# Altium project PROJECT_W-F-FC-HX2X.PrjPcb
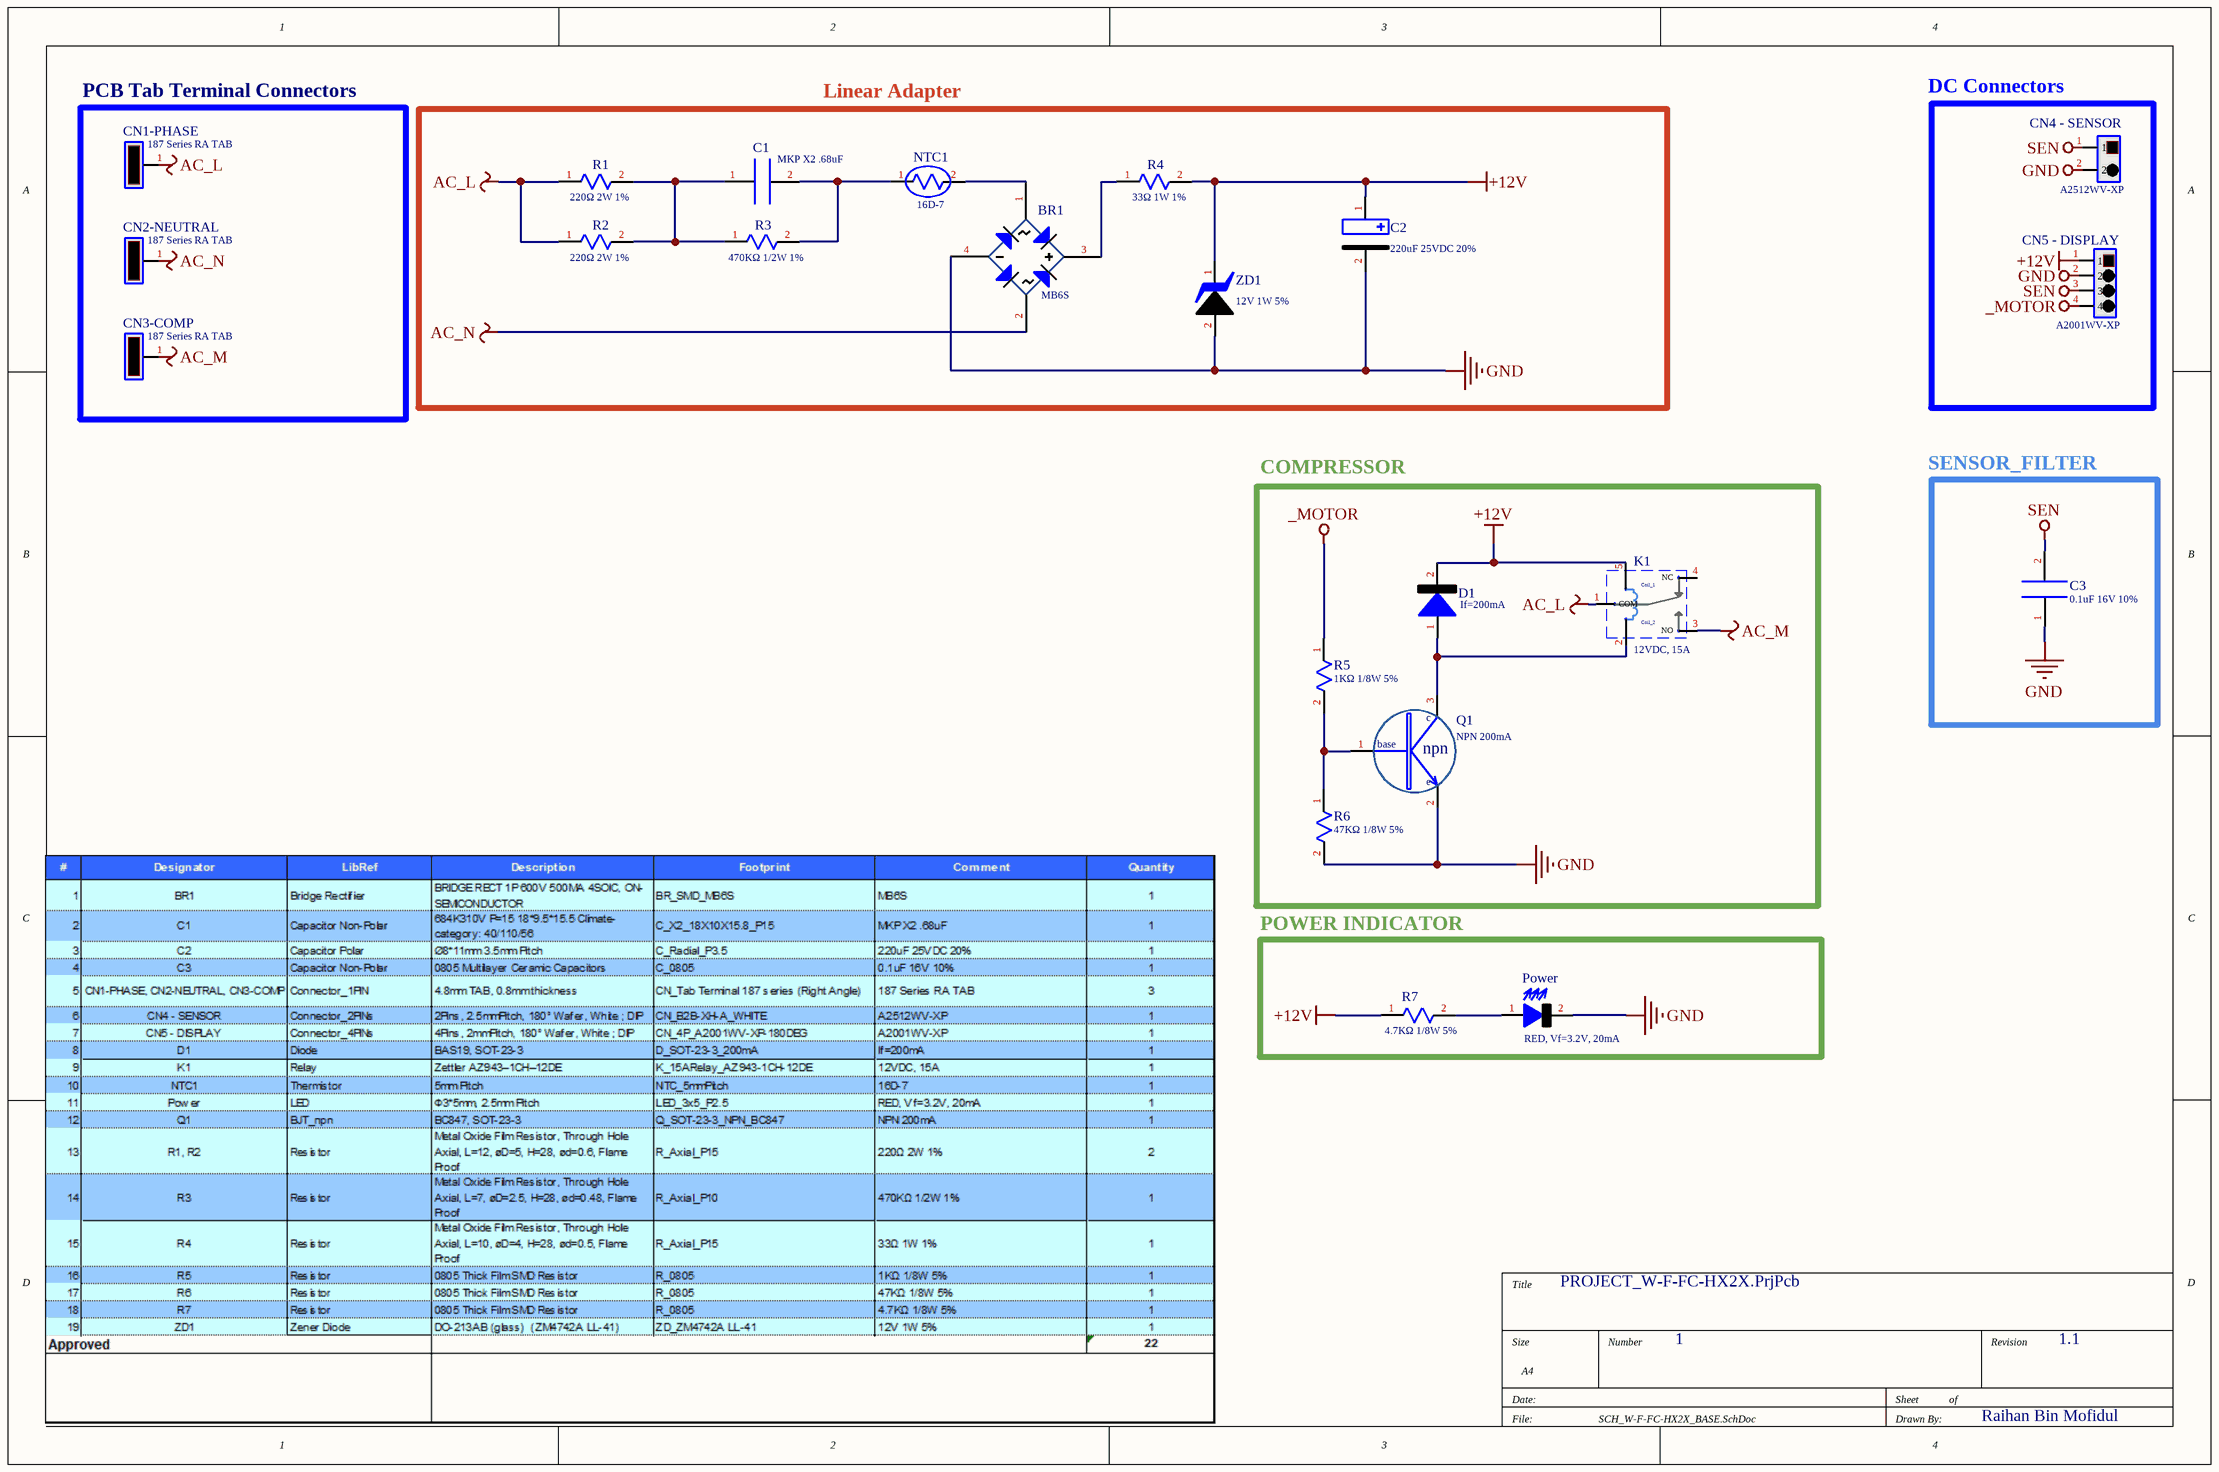
[diagram p0: SCH_W-F-FC-HX2X_BASE.SchDoc]
1 sheet, 22 parts. Net scope: global (net labels, ports and power ports of the same name join across sheets).
Board file: PCB_W-F-FC-HX2X_BASE.PcbDoc

## Sheet SCH_W-F-FC-HX2X_BASE.SchDoc
size A4

### Parts
BR1  MB6S  [BR_SMD_MB6S]
C1  MKP X2 .68uF  [C_X2_18X10X15.8_P15]
C2  220uF 25VDC 20%  [C_Radial_P3.5]
C3  0.1uF 16V 10%  [C_0805]
CN1-PHASE  187 Series RA TAB  [CN_Tab Terminal 187 series (Right Angle)]
CN2-NEUTRAL  187 Series RA TAB  [CN_Tab Terminal 187 series (Right Angle)]
CN3-COMP  187 Series RA TAB  [CN_Tab Terminal 187 series (Right Angle)]
CN4_-_SENSOR  A2512WV-XP  [CN_B2B-XH-A_WHITE]
CN5_-_DISPLAY  A2001WV-XP  [CN_4P_A2001WV-XP-180DEG]
D1  If=200mA  [D_SOT-23-3_200mA]
K1  12VDC, 15A  [K_15ARelay_AZ943-1CH-12DE]
NTC1  16D-7  [NTC_5mmPitch]
Power  RED, Vf=3.2V, 20mA  [LED_3x5_P2.5]
Q1  NPN 200mA  [Q_SOT-23-3_NPN_BC847]
R1  220Ω 2W 1%  [R_Axial_P15]
R2  220Ω 2W 1%  [R_Axial_P15]
R3  470KΩ 1/2W 1%  [R_Axial_P10]
R4  33Ω 1W 1%  [R_Axial_P15]
R5  1KΩ 1/8W 5%  [R_0805]
R6  47KΩ 1/8W 5%  [R_0805]
R7  4.7KΩ 1/8W 5%  [R_0805]
ZD1  12V 1W 5%  [ZD_ZM4742A LL-41]

### Blocks framed on the sheet
PCB Tab Terminal Connectors: CN1-PHASE CN2-NEUTRAL CN3-COMP
Linear Adapter: BR1 C1 C2 NTC1 R1-R4 ZD1
DC Connectors: CN4_-_SENSOR CN5_-_DISPLAY
COMPRESSOR: D1 K1 Q1 R5 R6
SENSOR_FILTER: C3
POWER INDICATOR: Power R7

### Nets
+12V: C2.1(vdd) CN5_-_DISPLAY.1 D1.2(vss) K1.5(COIL1) R4.2 R7.1 ZD1.1(VCC)
_MOTOR: CN5_-_DISPLAY.4 R5.1
AC_L: CN1-PHASE.1 K1.1(COM) R1.1 R2.1
AC_M: CN3-COMP.1 K1.3(NO)
AC_N: BR1.2(AC) CN2-NEUTRAL.1
GND: BR1.4(vss) C2.2(vss) C3.1 CN4_-_SENSOR.2 CN5_-_DISPLAY.2 Power.2(vss) Q1.2(Emitter) R6.2 ZD1.2(GND)
SEN: C3.2 CN4_-_SENSOR.1 CN5_-_DISPLAY.3
NetBR1_1: BR1.1(AC) NTC1.2
NetBR1_3: BR1.3(VCC) R4.1
NetC1_1: C1.1 R1.2 R2.2 R3.1
NetC1_2: C1.2 NTC1.1 R3.2
NetD1_1: D1.1(vdd) K1.2(COIL2) Q1.3(Collector)
NetPower_1: Power.1(vdd) R7.2
NetQ1_1: Q1.1(Base) R5.2 R6.1

Not connected (* = marked no-connect by the designer): K1 4(NC)

### Notes on the sheet
- 1
- 1.1
- Raihan Bin Mofidul
- (in symbol BJT_npn) c; base; npn; e
- (in symbol Relay) Coil_1; Coil_2

### Library data of the parts
BR1 = Bridge Rectifier: BRIDGE RECT 1P 600V 500MA 4SOIC, ON-SEMICONDUCTOR
C1 = Capacitor Non-Polar: 684K310V P=15 18*9.5*15.5 Climate-category: 40/110/56
C2 = Capacitor Polar: Ø8*11mm 3.5mm Pitch
C3 = Capacitor Non-Polar: 0805 Multilayer Ceramic Capacitors
CN1-PHASE CN2-NEUTRAL CN3-COMP = Connector_1PIN: 4.8mm TAB, 0.8mm thickness
CN4_-_SENSOR = Connector_2PINs: 2Pins, 2.5mmPitch, 180° Wafer, White ; DIP
CN5_-_DISPLAY = Connector_4PINs: 4Pins, 2mmPitch, 180° Wafer, White ; DIP
D1 = Diode: BAS19, SOT-23-3
K1 = Relay: Zettler AZ943–1CH–12DE
NTC1 = Thermistor: 5mm Pitch
Power = LED: Φ3*5mm, 2.5mm Pitch
Q1 = BJT_npn: BC847, SOT-23-3
R1 R2 = Resistor: Metal Oxide Film Resistor, Through Hole Axial, L=12, øD=5, H=28, ød=0.6, Flame Proof
R3 = Resistor: Metal Oxide Film Resistor, Through Hole Axial, L=7, øD=2.5, H=28, ød=0.48, Flame Proof
R4 = Resistor: Metal Oxide Film Resistor, Through Hole Axial, L=10, øD=4, H=28, ød=0.5, Flame Proof
R5-R7 = Resistor: 0805 Thick Film SMD Resistor
ZD1 = Zener Diode: DO-213AB (glass)  (ZM4742A LL-41)